# Altium schematic sheet Gagabiro_cover_letter.SchDoc
size 393 x 281 mm; SheetNumber: 1; SheetTotal: 4
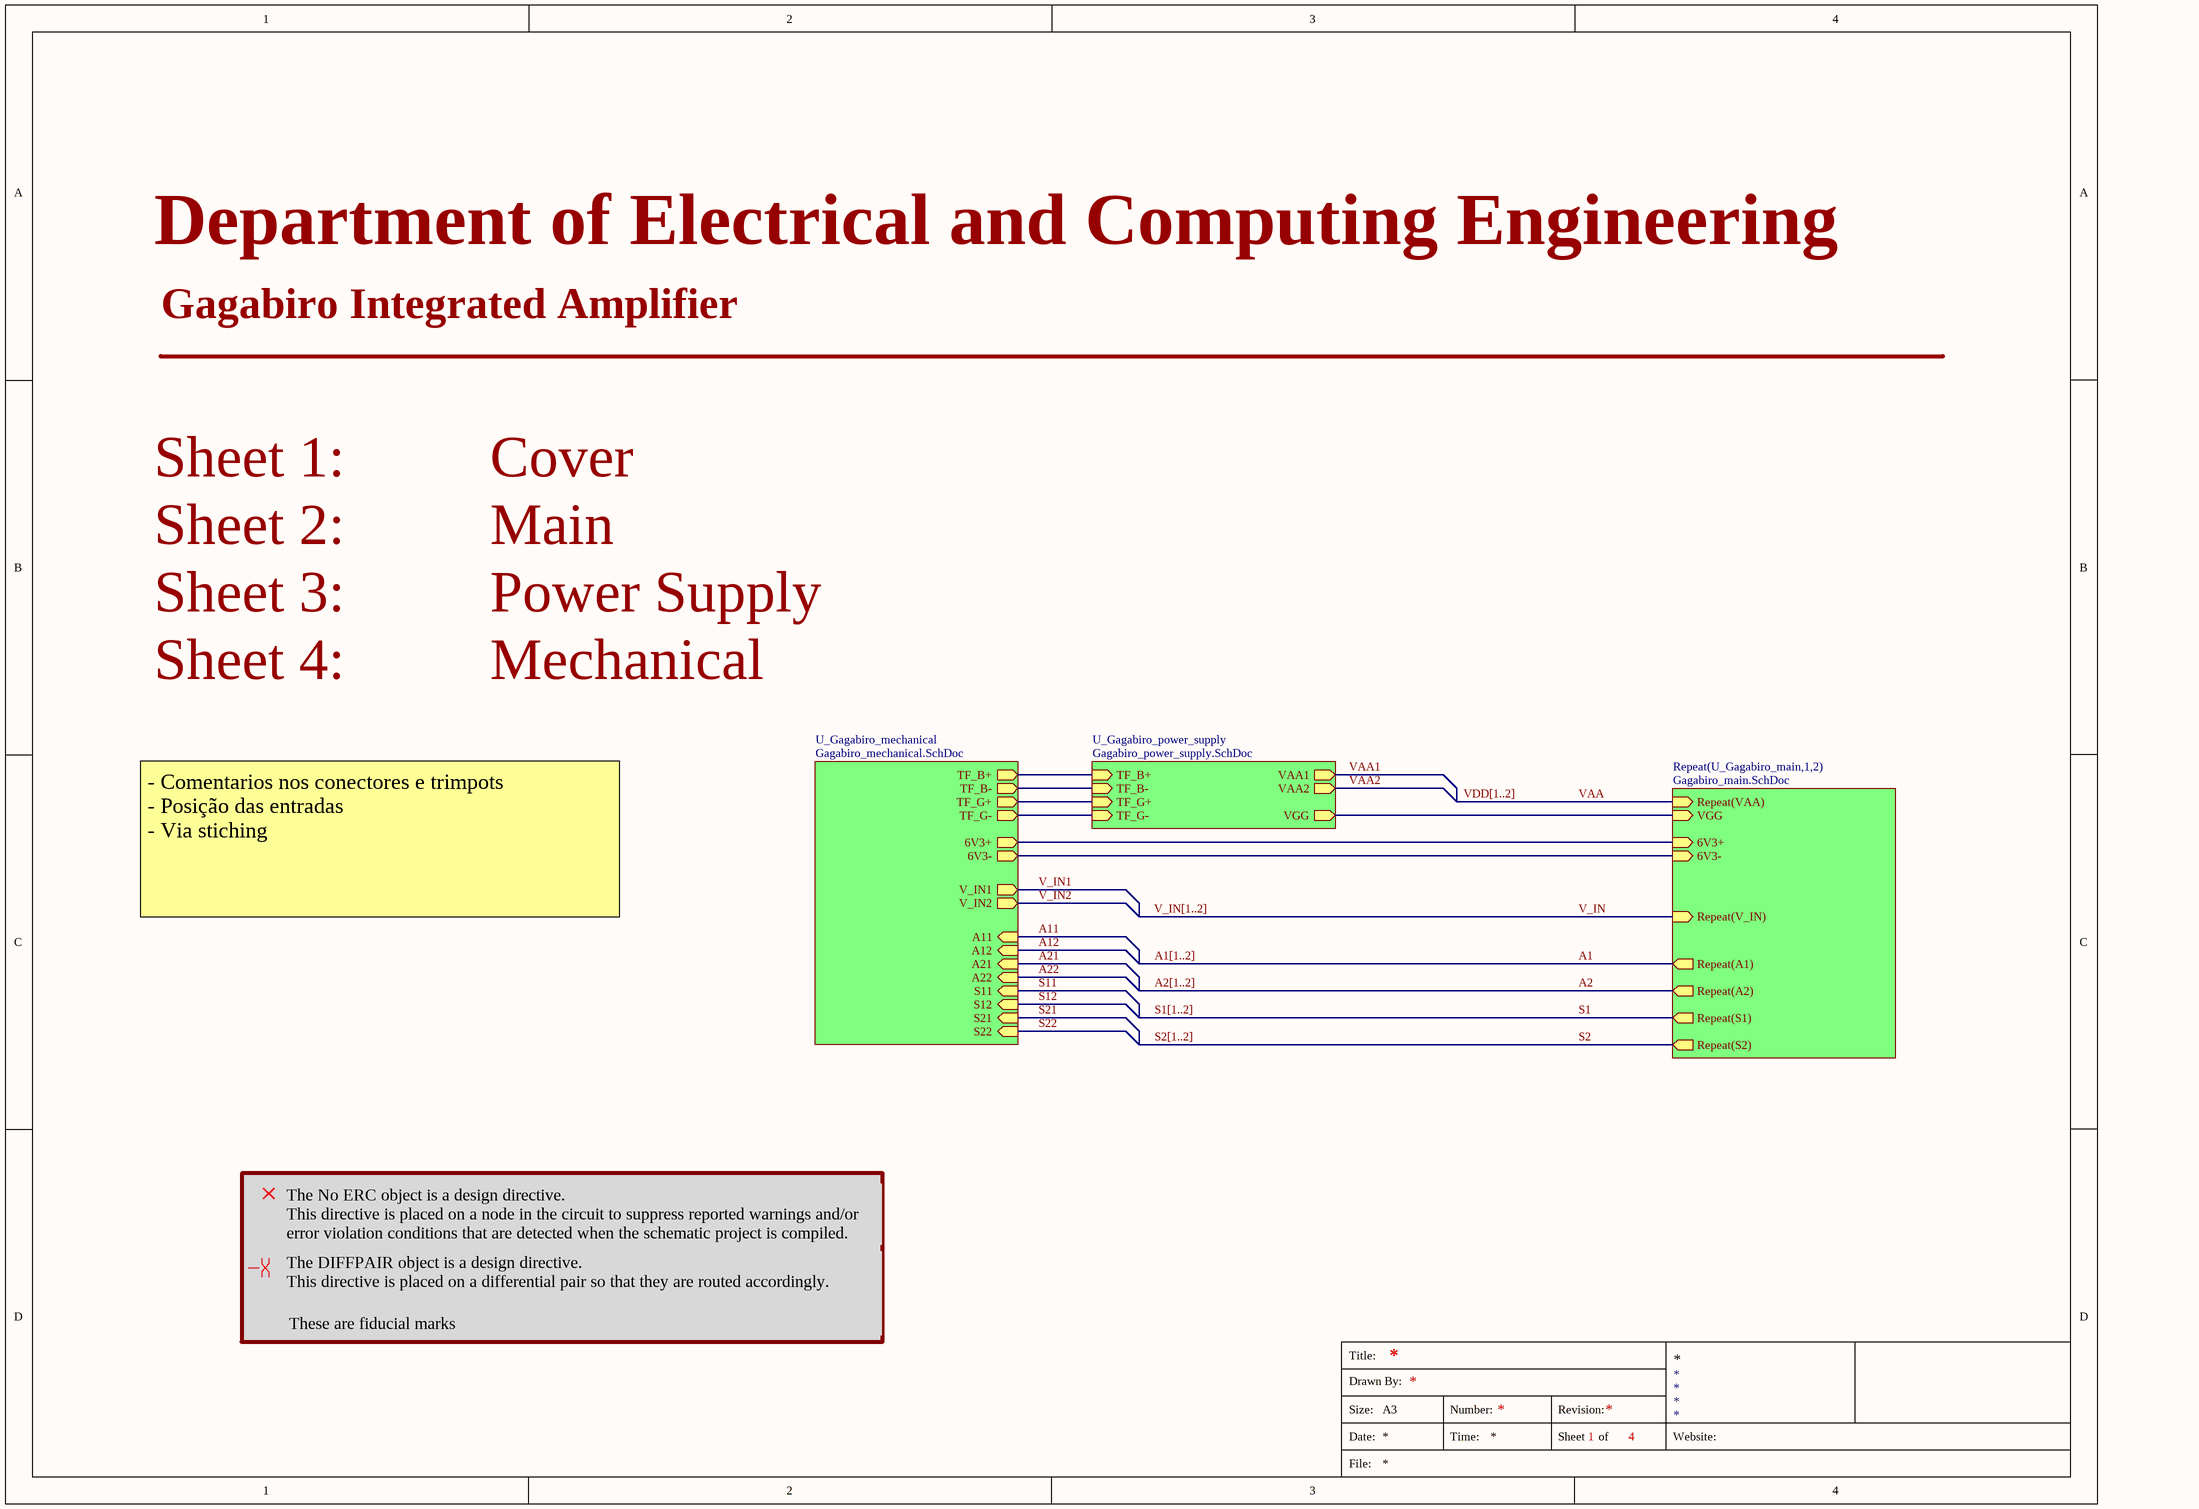
[diagram p0: Gagabiro_cover_letter.SchDoc]

## Sub-sheets
Repeat(U_Gagabiro_main,1,2) = Gagabiro_main.SchDoc: Repeat(VAA) (in), Repeat(V_IN) (in), 6V3+ (in), 6V3- (in), VGG (in), Repeat(A1) (out), Repeat(S1) (out), Repeat(A2) (out), Repeat(S2) (out)
U_Gagabiro_mechanical = Gagabiro_mechanical.SchDoc: 6V3+ (out), 6V3- (out), V_IN1 (out), V_IN2 (out), TF_B+ (out), TF_B- (out), A11 (in), S11 (in), A21 (in), S21 (in), A12 (in), S12 (in), A22 (in), S22 (in), TF_G+ (out), TF_G- (out)
U_Gagabiro_power_supply = Gagabiro_power_supply.SchDoc: TF_B+ (in), TF_B- (in), VAA1 (out), VAA2 (out), VGG (out), TF_G+ (in), TF_G- (in)

## Nets
A1: sheet Repeat(U_Gagabiro_main,1,2)/Repeat(A1)
A2: sheet Repeat(U_Gagabiro_main,1,2)/Repeat(A2)
A11: sheet U_Gagabiro_mechanical/A11
A12: sheet U_Gagabiro_mechanical/A12
A21: sheet U_Gagabiro_mechanical/A21
A22: sheet U_Gagabiro_mechanical/A22
S1: sheet Repeat(U_Gagabiro_main,1,2)/Repeat(S1)
S2: sheet Repeat(U_Gagabiro_main,1,2)/Repeat(S2)
S11: sheet U_Gagabiro_mechanical/S11
S12: sheet U_Gagabiro_mechanical/S12
S21: sheet U_Gagabiro_mechanical/S21
S22: sheet U_Gagabiro_mechanical/S22
V_IN: sheet Repeat(U_Gagabiro_main,1,2)/Repeat(V_IN)
V_IN1: sheet U_Gagabiro_mechanical/V_IN1
V_IN2: sheet U_Gagabiro_mechanical/V_IN2
VAA: sheet Repeat(U_Gagabiro_main,1,2)/Repeat(VAA)
VAA1: sheet U_Gagabiro_power_supply/VAA1
VAA2: sheet U_Gagabiro_power_supply/VAA2
(unnamed): sheet Repeat(U_Gagabiro_main,1,2)/6V3+, sheet U_Gagabiro_mechanical/6V3+
(unnamed): sheet Repeat(U_Gagabiro_main,1,2)/6V3-, sheet U_Gagabiro_mechanical/6V3-
(unnamed): sheet Repeat(U_Gagabiro_main,1,2)/VGG, sheet U_Gagabiro_power_supply/VGG
(unnamed): sheet U_Gagabiro_mechanical/TF_B+, sheet U_Gagabiro_power_supply/TF_B+
(unnamed): sheet U_Gagabiro_mechanical/TF_B-, sheet U_Gagabiro_power_supply/TF_B-
(unnamed): sheet U_Gagabiro_mechanical/TF_G+, sheet U_Gagabiro_power_supply/TF_G+
(unnamed): sheet U_Gagabiro_mechanical/TF_G-, sheet U_Gagabiro_power_supply/TF_G-

## Buses and harness runs
bus A1[1..2]
bus A2[1..2]
bus S1[1..2]
bus S2[1..2]
bus V_IN[1..2]
bus VDD[1..2]

## Layout directives
differential pair: (no net found under the mark)

## Notes on the sheet
- Department of Electrical and Computing Engineering
- Gagabiro Integrated Amplifier
- Sheet 1:          Cover
- Sheet 2:          Main
- Sheet 3:          Power Supply
- Sheet 4:          Mechanical
- - Comentarios nos conectores e trimpots
  - Posição das entradas
  - Via stiching
- The No ERC object is a design directive.
  This directive is placed on a node in the circuit to suppress reported warnings and/or error violation conditions that are detected when the schematic project is compiled.
- The DIFFPAIR object is a design directive.
  This directive is placed on a differential pair so that they are routed accordingly.
- These are fiducial marks
- Title:
- Drawn By:
- Size:
- Date:
- File:
- A3
- Number:
- Time:
- Revision:
- Sheet
- of
- Website: